# Altium schematic sheet Adapter_Func.SchDoc
size A4; SheetNumber: 1; SheetTotal: 7
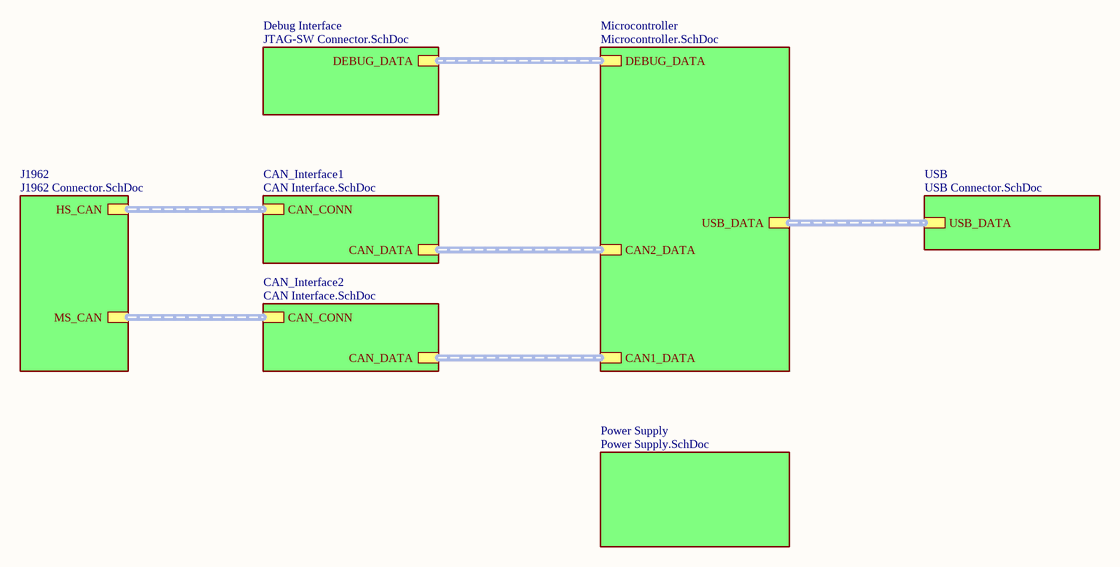
[diagram p0: Adapter_Func.SchDoc]

## Sub-sheets
CAN_Interface1 = CAN Interface.SchDoc: CAN_DATA (harness CAN_DATA), CAN_CONN (harness CAN_PHY)
CAN_Interface2 = CAN Interface.SchDoc: CAN_DATA (harness CAN_DATA), CAN_CONN (harness CAN_PHY)
Debug Interface = JTAG-SW Connector.SchDoc: DEBUG_DATA (harness JTAG_SWD)
J1962 = J1962 Connector.SchDoc: MS_CAN (harness CAN_PHY), HS_CAN (harness CAN_PHY)
Microcontroller = Microcontroller.SchDoc: DEBUG_DATA (harness JTAG_SWD), USB_DATA (harness USB_DATA), CAN2_DATA (harness CAN_DATA), CAN1_DATA (harness CAN_DATA)
Power Supply = Power Supply.SchDoc: no entries
USB = USB Connector.SchDoc: USB_DATA (harness USB_DATA)

## Buses and harness runs
harness sheet CAN_Interface1/CAN_CONN = sheet J1962/HS_CAN
harness sheet CAN_Interface1/CAN_DATA = sheet Microcontroller/CAN2_DATA
harness sheet CAN_Interface2/CAN_CONN = sheet J1962/MS_CAN
harness sheet CAN_Interface2/CAN_DATA = sheet Microcontroller/CAN1_DATA
harness sheet Debug Interface/DEBUG_DATA = sheet Microcontroller/DEBUG_DATA
harness sheet Microcontroller/USB_DATA = sheet USB/USB_DATA